# Altium schematic sheet Root_page.SchDoc
size A3; SheetNumber: 1; SheetTotal: 14
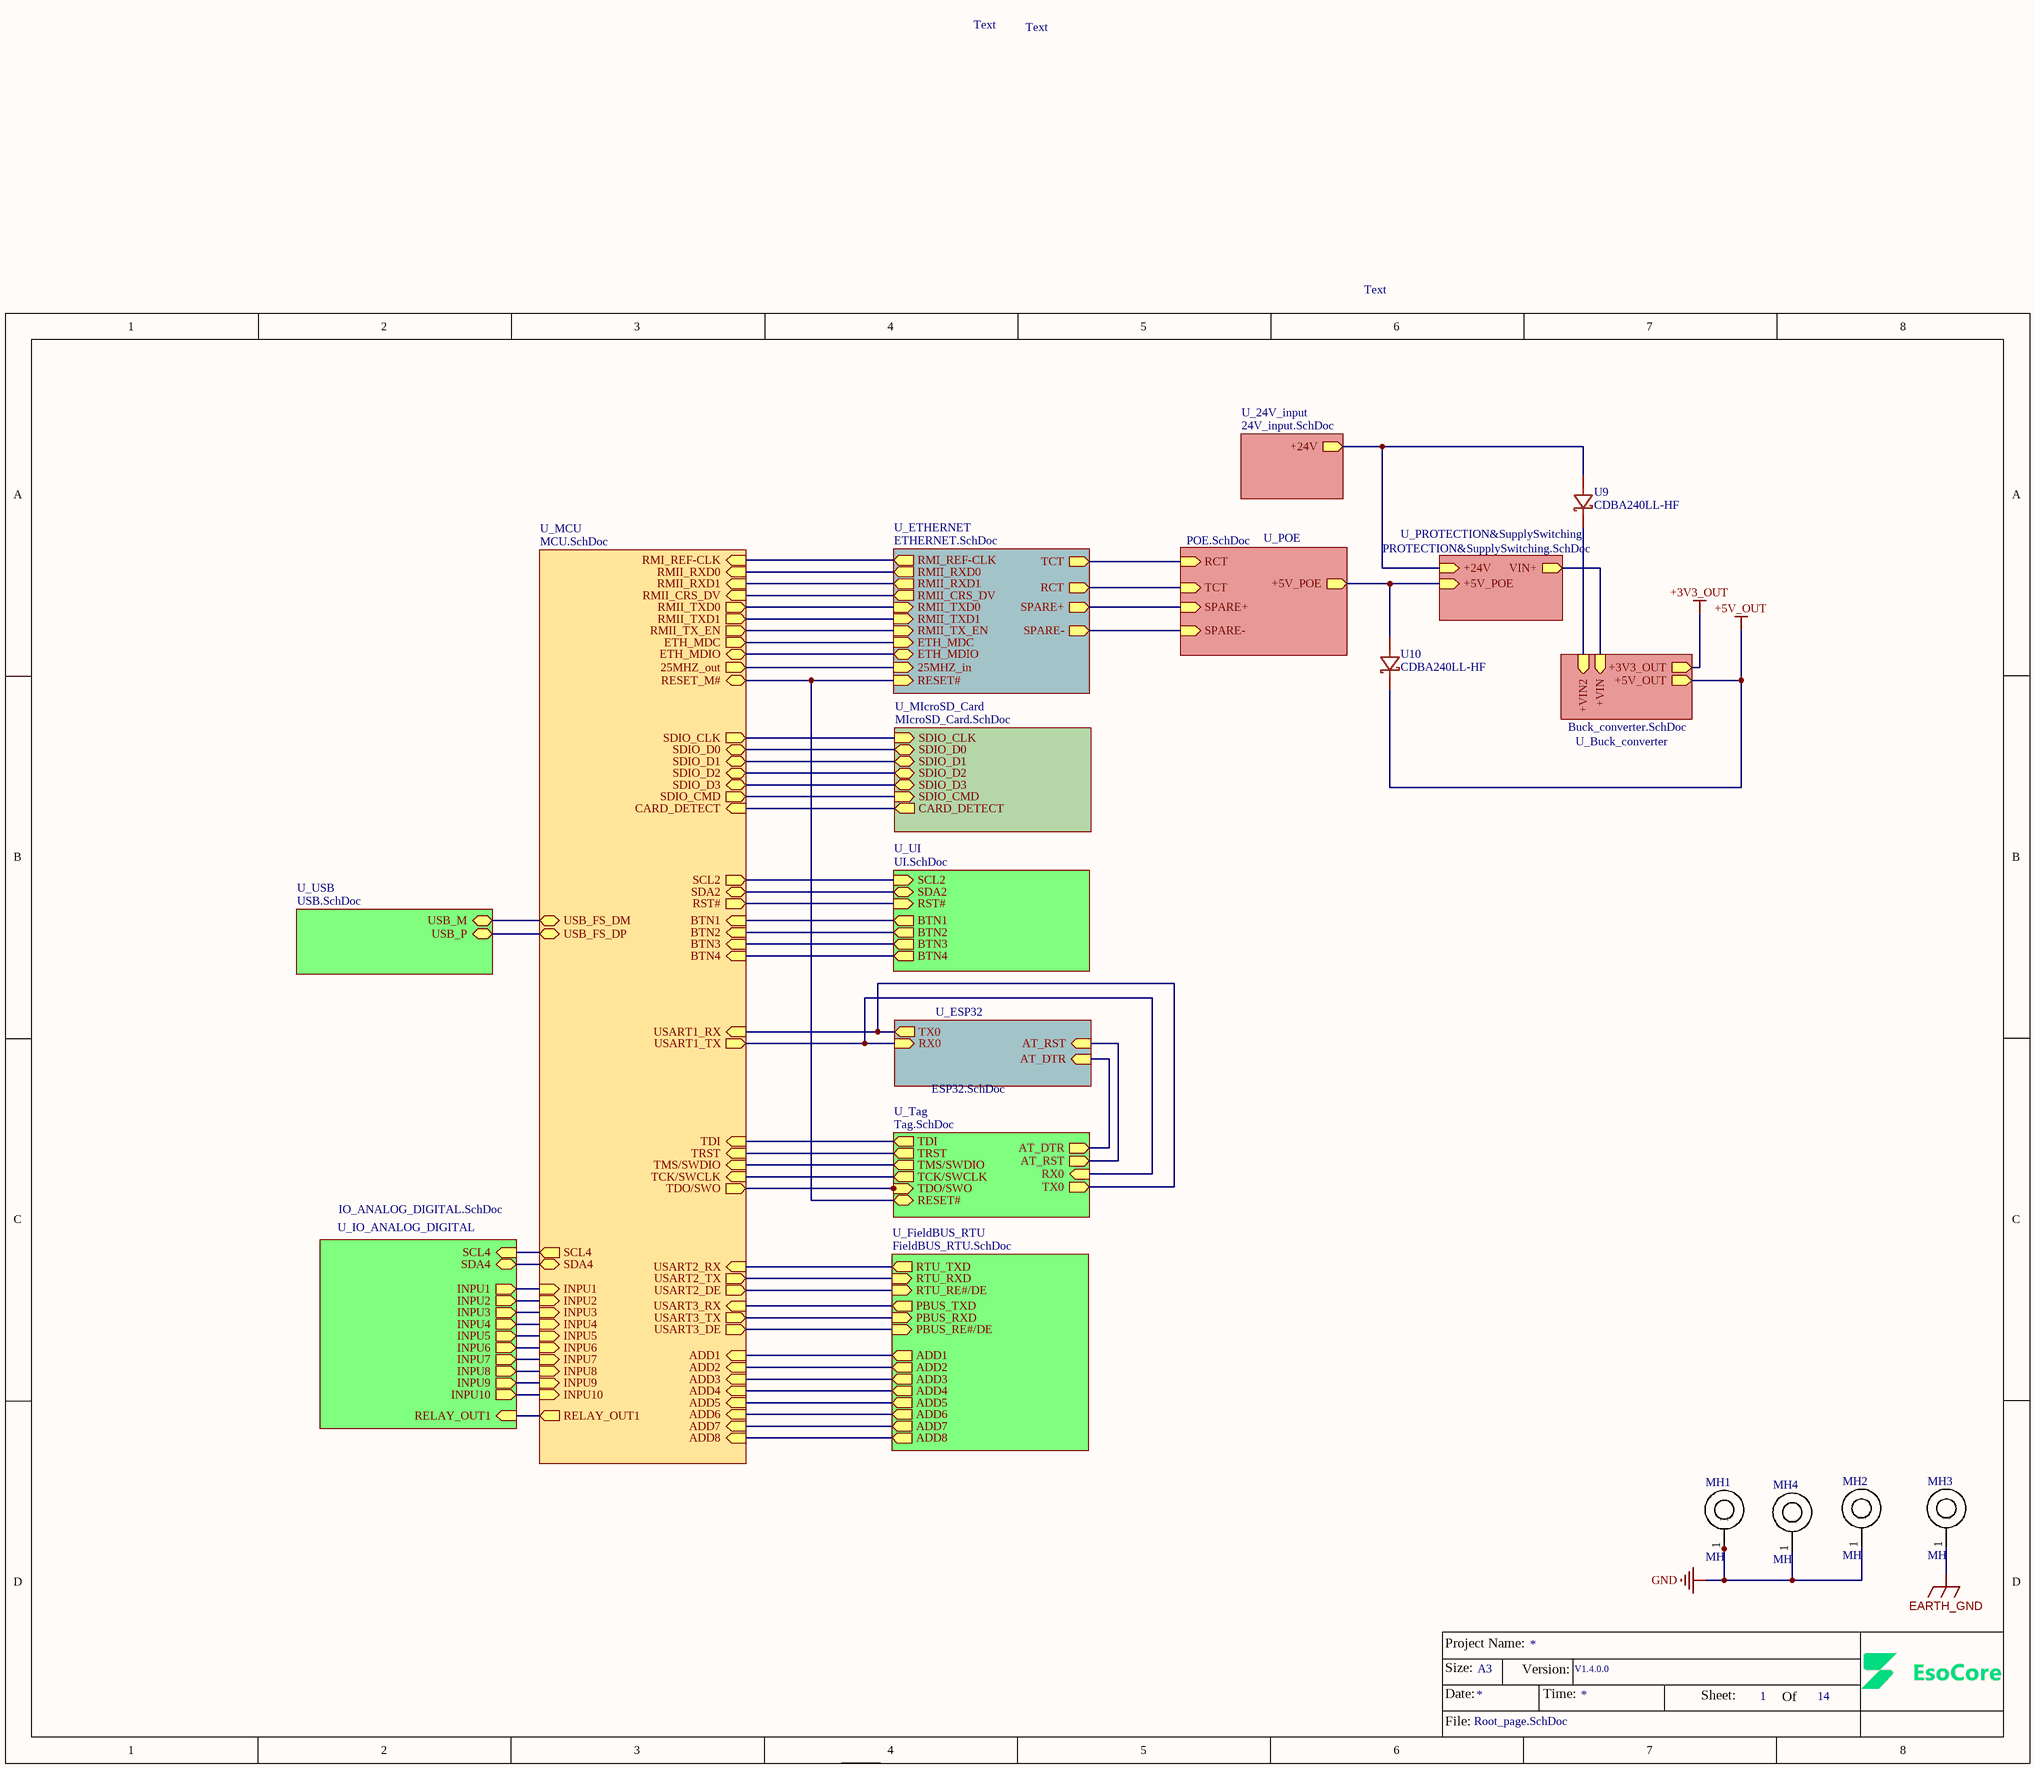
[diagram p0: Root_page.SchDoc]

## Parts
MH1  MH  [MountingHole_3.2mm_M3_Pad_Via]  (no BOM)
MH2  MH  [MountingHole_3.2mm_M3_Pad_Via]  (no BOM)
MH3  MH  [MountingHole_3.2mm_M3_Pad_Via]  (no BOM)
MH4  MH  [MountingHole_3.2mm_M3_Pad_Via]  (no BOM)
U9  CDBA240LL-HF  [SMA_L4.4-W2.5-LS5.2-R-RD]
U10  CDBA240LL-HF  [SMA_L4.4-W2.5-LS5.2-R-RD]

## Sub-sheets
U_24V_input = 24V_input.SchDoc: +24V (out)
U_Buck_converter = Buck_converter.SchDoc: +VIN (in), +3V3_OUT (out), +5V_OUT (out), +VIN2 (in)
U_ESP32 = ESP32.SchDoc: TX0 (out), RX0 (in), AT_RST (in), AT_DTR (in)
U_ETHERNET = ETHERNET.SchDoc: RMII_TX_EN (in), RMII_TXD0 (in), RMII_TXD1 (in), RMII_RXD0 (out), RMII_RXD1 (out), RMII_CRS_DV (out), ETH_MDC (in), ETH_MDIO (bidir), RESET# (in), RMI_REF-CLK (out), TCT (out), RCT (out), SPARE+ (out), SPARE- (out), 25MHZ_in (in)
U_FieldBUS_RTU = FieldBUS_RTU.SchDoc: RTU_RXD (in), RTU_RE#/DE (in), RTU_TXD (out), PBUS_RXD (in), PBUS_RE#/DE (in), PBUS_TXD (out), ADD1 (out), ADD2 (out), ADD3 (out), ADD4 (out), ADD5 (out), ADD6 (out), ADD7 (out), ADD8 (out)
U_IO_ANALOG_DIGITAL = IO_ANALOG_DIGITAL.SchDoc: INPU1 (out), INPU2 (out), INPU3 (out), INPU4 (out), INPU5 (out), INPU6 (out), INPU7 (out), INPU8 (out), INPU9 (out), INPU10 (out), SCL4 (in), SDA4 (bidir), RELAY_OUT1 (in)
U_MCU = MCU.SchDoc: RMII_RXD0 (in), RMII_RXD1 (in), RMII_TX_EN (out), RMII_TXD0 (out), RMII_TXD1 (out), RMII_CRS_DV (in), ETH_MDC (out), ETH_MDIO (bidir), RESET_M# (bidir), RMI_REF-CLK (in), SDIO_D2 (bidir), SDIO_D3 (bidir), SDIO_CLK (out), SDIO_D0 (bidir), SDIO_D1 (bidir), SDIO_CMD (out), CARD_DETECT (in), USB_FS_DP (bidir), USB_FS_DM (bidir), SCL2 (out), SDA2 (bidir), SCL4 (out), SDA4 (bidir), INPU1 (in), INPU2 (in), INPU3 (in), INPU4 (in), INPU5 (in), INPU6 (in), INPU7 (in), INPU8 (in), INPU9 (in), INPU10 (in), TMS/SWDIO (in), TCK/SWCLK (in), TDI (in), TDO/SWO (out), TRST (in), BTN1 (in), BTN2 (in), BTN3 (in), BTN4 (in), RST# (out), USART1_TX (out), USART1_RX (in), USART2_TX (out), USART2_RX (in), USART3_TX (out), USART3_RX (in), USART3_DE (out), USART2_DE (out), ADD1 (in), ADD2 (in), ADD3 (in), ADD4 (in), ADD5 (in), ADD6 (in), ADD7 (in), ADD8 (in), RELAY_OUT1 (out), 25MHZ_out (out)
U_MIcroSD_Card = MIcroSD_Card.SchDoc: SDIO_D2 (bidir), SDIO_D3 (bidir), SDIO_CLK (in), SDIO_D0 (bidir), SDIO_D1 (bidir), SDIO_CMD (in), CARD_DETECT (out)
U_POE = POE.SchDoc: SPARE+ (in), SPARE- (in), TCT (in), RCT (in), +5V_POE (out)
U_PROTECTION&SupplySwitching = PROTECTION&SupplySwitching.SchDoc: VIN+ (out), +24V (in), +5V_POE (in)
U_Tag = Tag.SchDoc: TMS/SWDIO (out), TCK/SWCLK (out), TDI (out), TDO/SWO (in), TRST (out), RESET# (bidir), TX0 (out), RX0 (in), AT_DTR (out), AT_RST (out)
U_UI = UI.SchDoc: SCL2 (in), SDA2 (bidir), BTN1 (out), BTN2 (out), BTN3 (out), BTN4 (out), RST# (in)
U_USB = USB.SchDoc: USB_P (bidir), USB_M (bidir)

## Nets
+3V3_OUT: sheet U_Buck_converter/+3V3_OUT
+5V_OUT: U10.2(K) ; sheet U_Buck_converter/+5V_OUT
EARTH_GND: MH3.1
GND: MH1.1 MH2.1 MH4.1
NetU9_1: U9.1(A) ; sheet U_24V_input/+24V, sheet U_PROTECTION&SupplySwitching/+24V
NetU9_2: U9.2(K) ; sheet U_Buck_converter/+VIN2
NetU10_1: U10.1(A) ; sheet U_POE/+5V_POE, sheet U_PROTECTION&SupplySwitching/+5V_POE
(unnamed): sheet U_UI/SCL2, sheet U_MCU/SCL2
(unnamed): sheet U_UI/SDA2, sheet U_MCU/SDA2
(unnamed): sheet U_UI/BTN1, sheet U_MCU/BTN1
(unnamed): sheet U_UI/BTN2, sheet U_MCU/BTN2
(unnamed): sheet U_UI/BTN3, sheet U_MCU/BTN3
(unnamed): sheet U_UI/BTN4, sheet U_MCU/BTN4
(unnamed): sheet U_UI/RST#, sheet U_MCU/RST#
(unnamed): sheet U_ETHERNET/RMII_TX_EN, sheet U_MCU/RMII_TX_EN
(unnamed): sheet U_ETHERNET/RMII_TXD0, sheet U_MCU/RMII_TXD0
(unnamed): sheet U_ETHERNET/RMII_TXD1, sheet U_MCU/RMII_TXD1
(unnamed): sheet U_ETHERNET/RMII_RXD0, sheet U_MCU/RMII_RXD0
(unnamed): sheet U_ETHERNET/RMII_RXD1, sheet U_MCU/RMII_RXD1
(unnamed): sheet U_ETHERNET/RMII_CRS_DV, sheet U_MCU/RMII_CRS_DV
(unnamed): sheet U_ETHERNET/ETH_MDC, sheet U_MCU/ETH_MDC
(unnamed): sheet U_ETHERNET/ETH_MDIO, sheet U_MCU/ETH_MDIO
(unnamed): sheet U_ETHERNET/RESET#, sheet U_Tag/RESET#, sheet U_MCU/RESET_M#
(unnamed): sheet U_ETHERNET/RMI_REF-CLK, sheet U_MCU/RMI_REF-CLK
(unnamed): sheet U_ETHERNET/TCT, sheet U_POE/RCT
(unnamed): sheet U_ETHERNET/RCT, sheet U_POE/TCT
(unnamed): sheet U_ETHERNET/SPARE+, sheet U_POE/SPARE+
(unnamed): sheet U_ETHERNET/SPARE-, sheet U_POE/SPARE-
(unnamed): sheet U_ETHERNET/25MHZ_in, sheet U_MCU/25MHZ_out
(unnamed): sheet U_PROTECTION&SupplySwitching/VIN+, sheet U_Buck_converter/+VIN
(unnamed): sheet U_MIcroSD_Card/SDIO_D2, sheet U_MCU/SDIO_D2
(unnamed): sheet U_MIcroSD_Card/SDIO_D3, sheet U_MCU/SDIO_D3
(unnamed): sheet U_MIcroSD_Card/SDIO_CLK, sheet U_MCU/SDIO_CLK
(unnamed): sheet U_MIcroSD_Card/SDIO_D0, sheet U_MCU/SDIO_D0
(unnamed): sheet U_MIcroSD_Card/SDIO_D1, sheet U_MCU/SDIO_D1
(unnamed): sheet U_MIcroSD_Card/SDIO_CMD, sheet U_MCU/SDIO_CMD
(unnamed): sheet U_MIcroSD_Card/CARD_DETECT, sheet U_MCU/CARD_DETECT
(unnamed): sheet U_ESP32/TX0, sheet U_Tag/TX0, sheet U_MCU/USART1_RX
(unnamed): sheet U_ESP32/RX0, sheet U_Tag/RX0, sheet U_MCU/USART1_TX
(unnamed): sheet U_ESP32/AT_RST, sheet U_Tag/AT_RST
(unnamed): sheet U_ESP32/AT_DTR, sheet U_Tag/AT_DTR
(unnamed): sheet U_Tag/TMS/SWDIO, sheet U_MCU/TMS/SWDIO
(unnamed): sheet U_Tag/TCK/SWCLK, sheet U_MCU/TCK/SWCLK
(unnamed): sheet U_Tag/TDI, sheet U_MCU/TDI
(unnamed): sheet U_Tag/TDO/SWO, sheet U_MCU/TDO/SWO
(unnamed): sheet U_Tag/TRST, sheet U_MCU/TRST
(unnamed): sheet U_FieldBUS_RTU/RTU_RXD, sheet U_MCU/USART2_TX
(unnamed): sheet U_FieldBUS_RTU/RTU_RE#/DE, sheet U_MCU/USART2_DE
(unnamed): sheet U_FieldBUS_RTU/RTU_TXD, sheet U_MCU/USART2_RX
(unnamed): sheet U_FieldBUS_RTU/PBUS_RXD, sheet U_MCU/USART3_TX
(unnamed): sheet U_FieldBUS_RTU/PBUS_RE#/DE, sheet U_MCU/USART3_DE
(unnamed): sheet U_FieldBUS_RTU/PBUS_TXD, sheet U_MCU/USART3_RX
(unnamed): sheet U_FieldBUS_RTU/ADD1, sheet U_MCU/ADD1
(unnamed): sheet U_FieldBUS_RTU/ADD2, sheet U_MCU/ADD2
(unnamed): sheet U_FieldBUS_RTU/ADD3, sheet U_MCU/ADD3
(unnamed): sheet U_FieldBUS_RTU/ADD4, sheet U_MCU/ADD4
(unnamed): sheet U_FieldBUS_RTU/ADD5, sheet U_MCU/ADD5
(unnamed): sheet U_FieldBUS_RTU/ADD6, sheet U_MCU/ADD6
(unnamed): sheet U_FieldBUS_RTU/ADD7, sheet U_MCU/ADD7
(unnamed): sheet U_FieldBUS_RTU/ADD8, sheet U_MCU/ADD8
(unnamed): sheet U_IO_ANALOG_DIGITAL/INPU1, sheet U_MCU/INPU1
(unnamed): sheet U_IO_ANALOG_DIGITAL/INPU2, sheet U_MCU/INPU2
(unnamed): sheet U_IO_ANALOG_DIGITAL/INPU3, sheet U_MCU/INPU3
(unnamed): sheet U_IO_ANALOG_DIGITAL/INPU4, sheet U_MCU/INPU4
(unnamed): sheet U_IO_ANALOG_DIGITAL/INPU5, sheet U_MCU/INPU5
(unnamed): sheet U_IO_ANALOG_DIGITAL/INPU6, sheet U_MCU/INPU6
(unnamed): sheet U_IO_ANALOG_DIGITAL/INPU7, sheet U_MCU/INPU7
(unnamed): sheet U_IO_ANALOG_DIGITAL/INPU8, sheet U_MCU/INPU8
(unnamed): sheet U_IO_ANALOG_DIGITAL/INPU9, sheet U_MCU/INPU9
(unnamed): sheet U_IO_ANALOG_DIGITAL/INPU10, sheet U_MCU/INPU10
(unnamed): sheet U_IO_ANALOG_DIGITAL/SCL4, sheet U_MCU/SCL4
(unnamed): sheet U_IO_ANALOG_DIGITAL/SDA4, sheet U_MCU/SDA4
(unnamed): sheet U_IO_ANALOG_DIGITAL/RELAY_OUT1, sheet U_MCU/RELAY_OUT1
(unnamed): sheet U_MCU/USB_FS_DP, sheet U_USB/USB_P
(unnamed): sheet U_MCU/USB_FS_DM, sheet U_USB/USB_M

## Notes on the sheet
- Text
- Project Name:
- Size:
- Date:
- A3
- Version:
- Time:
- V1.4.0.0
- Sheet:
- Of
- File:

## Library data of the parts
U9 U10 = CDBA240LL-HF: Manufacturer: Comchip(典琦); Add into BOM: yes; Voltage - Forward(Vf@If): 310mV@2A; Voltage - DC Reverse(Vr): 40V; Current - Rectified: 2A; Reverse Leakage Current (Ir): 200uA@40V; Operating Junction Temperature Range: -55℃~+100℃; Non-Repetitive Peak Forward Surge Current: 70A; Symbol: CDBA240LL-HF; Device: CDBA240LL-HF; LCSC Part Name: 电压:40V 电流:2A; Supplier Part: C2886093; Manufacturer Part: CDBA240LL-HF; Supplier Footprint: SMA(DO-214AC); JLCPCB Part Class: Extended Part; Datasheet: https://item.szlcsc.com/datasheet/CDBA240LL-HF/3097132.html; Supplier: LCSC; Convert to PCB: yes